# EAGLE design raveGear301 (EAGLE 6.6.0)
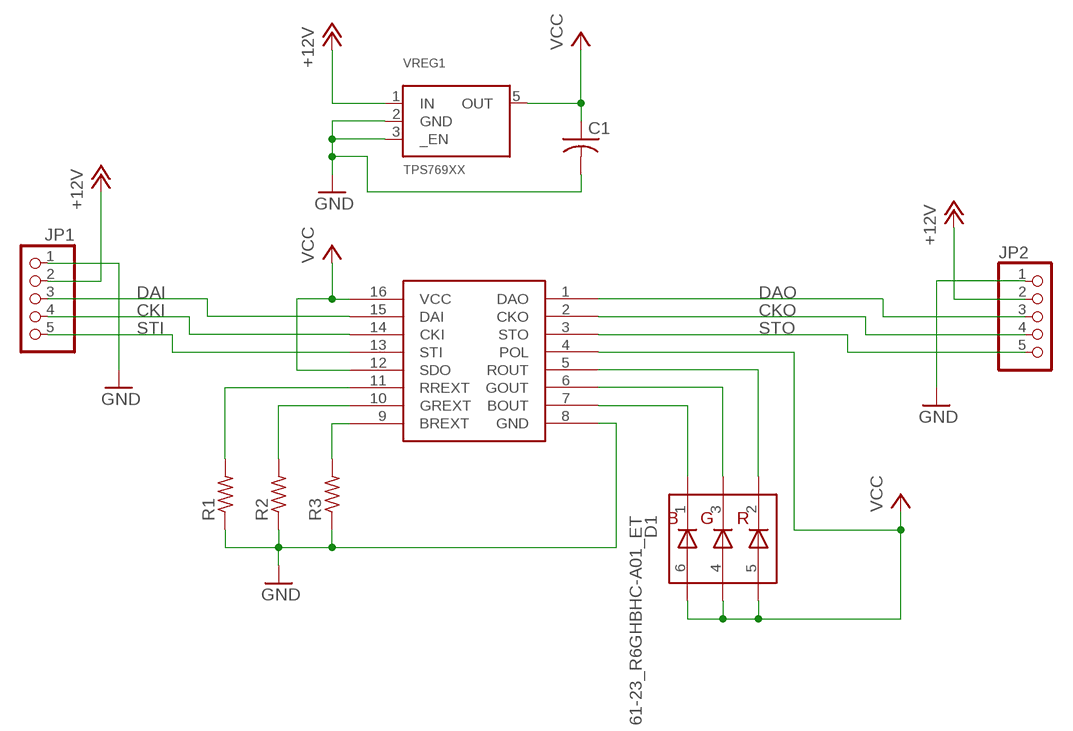
[diagram p0: schematic, sheet 1]

## Parts
C1  C-USC0603  [C0603]
D1  61-23_R6GHBHC-A01_ET  [LF-6]
JP1  PINHD-1X5  [1X05]
JP2  PINHD-1X5  [1X05]
R1  R-US_R0402  [R0402]
R2  R-US_R0402  [R0402]
R3  R-US_R0402  [R0402]
U1  DM412BEST  [SSOP16]
VREG1  TPS769XX  [SOT23-5L]

## Nets
+12V: JP1.2 JP2.2 VREG1.1(IN)
BOUT: D1.1(CB) U1.7(BOUT)
BREXT: R3.2 U1.9(BREXT)
CKI: JP1.4 U1.14(CKI)
CKO: JP2.4 U1.2(CKO)
DAI: JP1.3 U1.15(DAI)
DAO: JP2.3 U1.1(DAO)
GND: C1.2 JP1.1 JP2.1 R1.1 R2.1 R3.1 U1.8(GND) VREG1.2(GND) VREG1.3(_EN)
GOUT: D1.3(CG) U1.6(GOUT)
GREXT: R2.2 U1.10(GREXT)
ROUT: D1.2(CR) U1.5(ROUT)
RREXT: R1.2 U1.11(RREXT)
STI: JP1.5 U1.13(STI)
STO: JP2.5 U1.3(STO)
VCC: C1.1 D1.4(AG) D1.5(AR) D1.6(AB) U1.4(POL) U1.12(SDO) U1.16(VCC) VREG1.5(OUT)

## Library data of the parts
C1 = rcl:C-US: CAPACITOR, American symbol
D1 = raveGear3_2:61-23_R6GHBHC-A01_ET
JP1 JP2 = raveGear3_2:PINHD-1X5: PIN HEADER
R1-R3 = rcl:R-US_: RESISTOR, American symbol
U1 = raveGear3_2:DM412
VREG1 = raveGear3_2:TPS769XX

## Board
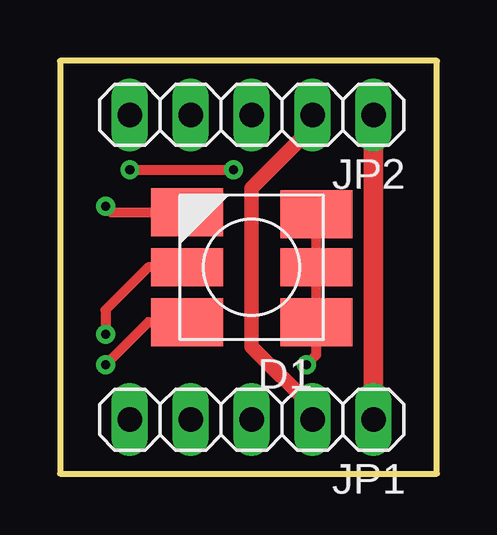
[diagram p1: board, top side]
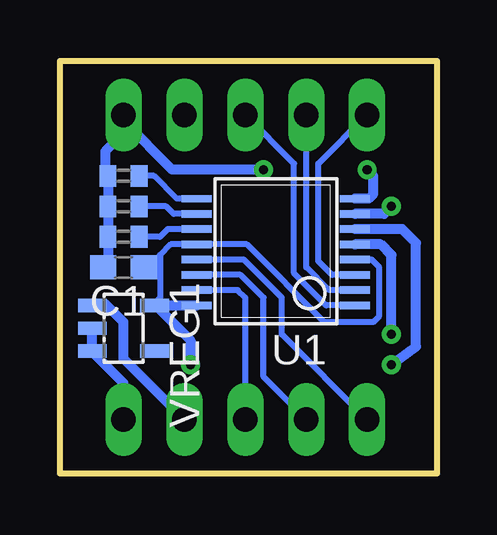
[diagram p2: board, bottom side, seen from below]

Size 15.73 x 17.2 mm. Coordinates in mm from the lower left corner, seen from the top.
Outline: 0,0 15.73,0 15.73,17.2 0,17.2 0,0
Copper layers (1*16): Top 0.035mm / dielectric 1.5mm / Bottom 0.035mm
Design rules "default": minimum track width 7mil, minimum drill 15mil, track to track 7mil, track to pad 7mil, pad to pad 8mil, via to via 8mil, smd to smd 7mil, copper to edge 20mil, drill to drill 8mil, minimum pad ring 10mil, minimum via ring 8mil, stop-mask expansion 4mil, vias tented up to drill 0mil, thermal gap 10mil

### Footprints (pad centres in the part's own frame; a part is rotated, then mirrored left to right if it is on the bottom)
C0603 = smd 1.1 x 1: 1 -0.85,0; 2 0.85,0
LF-6 = smd 2 x 3: 1 2.3,2.7; 3 -2.3,2.7; 4 -2.3,-2.7; 6 2.2,-2.7 | smd 1.6 x 3: 2 0,2.7; 5 0,-2.7
1X05 = drill 1.016 long: 1 -5.08,0; 2 -2.54,0; 3 0,0; 4 2.54,0; 5 5.08,0
R0402 = smd 0.7 x 0.9: 1 -0.65,0; 2 0.65,0
SSOP16 = smd 0.305 x 1.245: 1 -2.857,-3.302; 2 -2.222,-3.302; 3 -1.587,-3.302; 4 -0.952,-3.302; 5 -0.317,-3.302; 6 0.318,-3.302; 7 0.953,-3.302; 8 1.588,-3.302; 9 1.588,3.302; 10 0.953,3.302; 11 0.318,3.302; 12 -0.317,3.302; 13 -0.952,3.302; 14 -1.587,3.302; 15 -2.222,3.302; 16 -2.857,3.302
SOT23-5L = smd 0.55 x 1.2: 1 -0.95,-1.3; 2 0,-1.3; 3 0.95,-1.3; 4 0.95,1.3; 5 -0.95,1.3

### Placement (x,y rotation side)
C1  13.08,8.6 180 bottom
D1  8,8.6 90 top
JP1  8,2.25 180 top
JP2  8,14.95 180 top
R1  13.08,9.87 0 bottom
R2  13.08,11.14 0 bottom
R3  13.08,12.41 0 bottom
U1  6.73,9.87 90 bottom
VREG1  13.08,6.06 270 bottom

### Tracks (layer width: path | path; a pad name or v marks a point on that pad's centre or on a via)
+12V
  Top 0.61: JP1.2 10.54,2.76 8,5.3 8,11.9 10.54,14.44 JP2.2
  Bottom 0.406: JP1.2 13.08,4.79 13.08,6.31 13.84,7.07 14.35,7.07 14.38,7.04 VREG1.1
BOUT  (via drill 0.38 pad 0.3)
  Top 0.406: v1.9,11.14 2.15,10.88 5.2,10.88 5.22,10.9 D1.1
  Bottom 0.406: U1.7 2.22,10.82 v1.9,11.14
BREXT
  Bottom 0.254: U1.9 10.85,11.46 11.81,12.41 R3.2
CKI
  Bottom 0.254: U1.14 8.19,8.28 7.23,7.33 7.23,4.03 JP1.4
CKO
  Bottom 0.254: U1.2 4.5,7.65 5.46,8.6 JP2.4
DAI
  Bottom 0.254: U1.15 8.31,7.65 8,7.33 JP1.3
DAO
  Bottom 0.254: U1.1 4.63,7.01 5.96,8.34 5.96,12.92 JP2.3
GND  (via drill 0.38 pad 0.3)
  Top 0.406: v2.92,12.66 v7.23,12.66
  Top 0.813: JP1.1 JP2.1
  Bottom 0.406: JP1.1 13.08,3.77 14.38,5.07 VREG1.3 14.38,6.03 14.35,6.06 VREG1.2 | U1.8 2.85,11.46 2.66,11.65 2.66,12.41 v2.92,12.66 | C1.2 13.84,8.6 13.73,8.71 R1.1 13.84,9.87 13.73,9.98 R2.1 13.84,11.14 13.73,11.25 R3.1 13.84,12.41 13.84,13.42 13.08,14.19 JP2.1 13.08,14.69 11.04,12.66 v7.23,12.66
GOUT  (via drill 0.38 pad 0.3)
  Top 0.406: D1.3 5.22,6.3 5.2,6.31 3.68,6.31 v1.9,4.53
  Bottom 0.406: U1.6 1.46,10.19 0.88,9.61 0.88,5.3 v1.9,4.53
GREXT
  Bottom 0.254: U1.10 10.98,10.82 11.3,11.14 R2.2
ROUT  (via drill 0.38 pad 0.3)
  Top 0.406: 5.46,8.6 D1.2 3.68,8.6 1.9,6.82 v1.9,5.8
  Bottom 0.406: U1.5 2.35,9.55 1.9,9.11 v1.9,5.8
RREXT
  Bottom 0.254: U1.11 11.23,10.19 11.55,9.87 R1.2 12.57,9.87
STI
  Bottom 0.254: U1.13 8.06,8.92 6.47,7.33 6.47,5.8 JP1.5
STO
  Bottom 0.254: U1.3 4.38,8.28 4.95,8.85 4.95,12.92 JP2.5
VCC  (via drill 0.38 pad 0.3)
  Top 0.406: D1.5 10.54,8.6 10.7,8.76 | 10.7,8.76 D1.6 | D1.4 10.7,6.22 10.54,6.06 | D1.4 10.7,8.76 | D1.4 10.7,4.95 v10.28,4.53
  Bottom 0.254: U1.4 2.73,8.92 2.41,8.6 2.41,6.57 2.66,6.31 4.69,6.31 7.93,9.55 U1.12 11.11,9.55 11.55,9.11 11.55,8.6 | VREG1.5 11.78,7.04 11.81,7.07 11.55,7.33 11.55,8.6 | 11.55,8.6 C1.1
  Bottom 0.406: 11.81,7.01 VREG1.5 | 11.81,7.01 U1.16 | 11.81,7.01 11.81,7.07 10.28,5.55 v10.28,4.53